# Altium project MAIN_BOARD.PrjPcb (part 3 of 3)

## Sheet NVME.SchDoc
size B; SheetNumber: 7; SheetTotal: 8
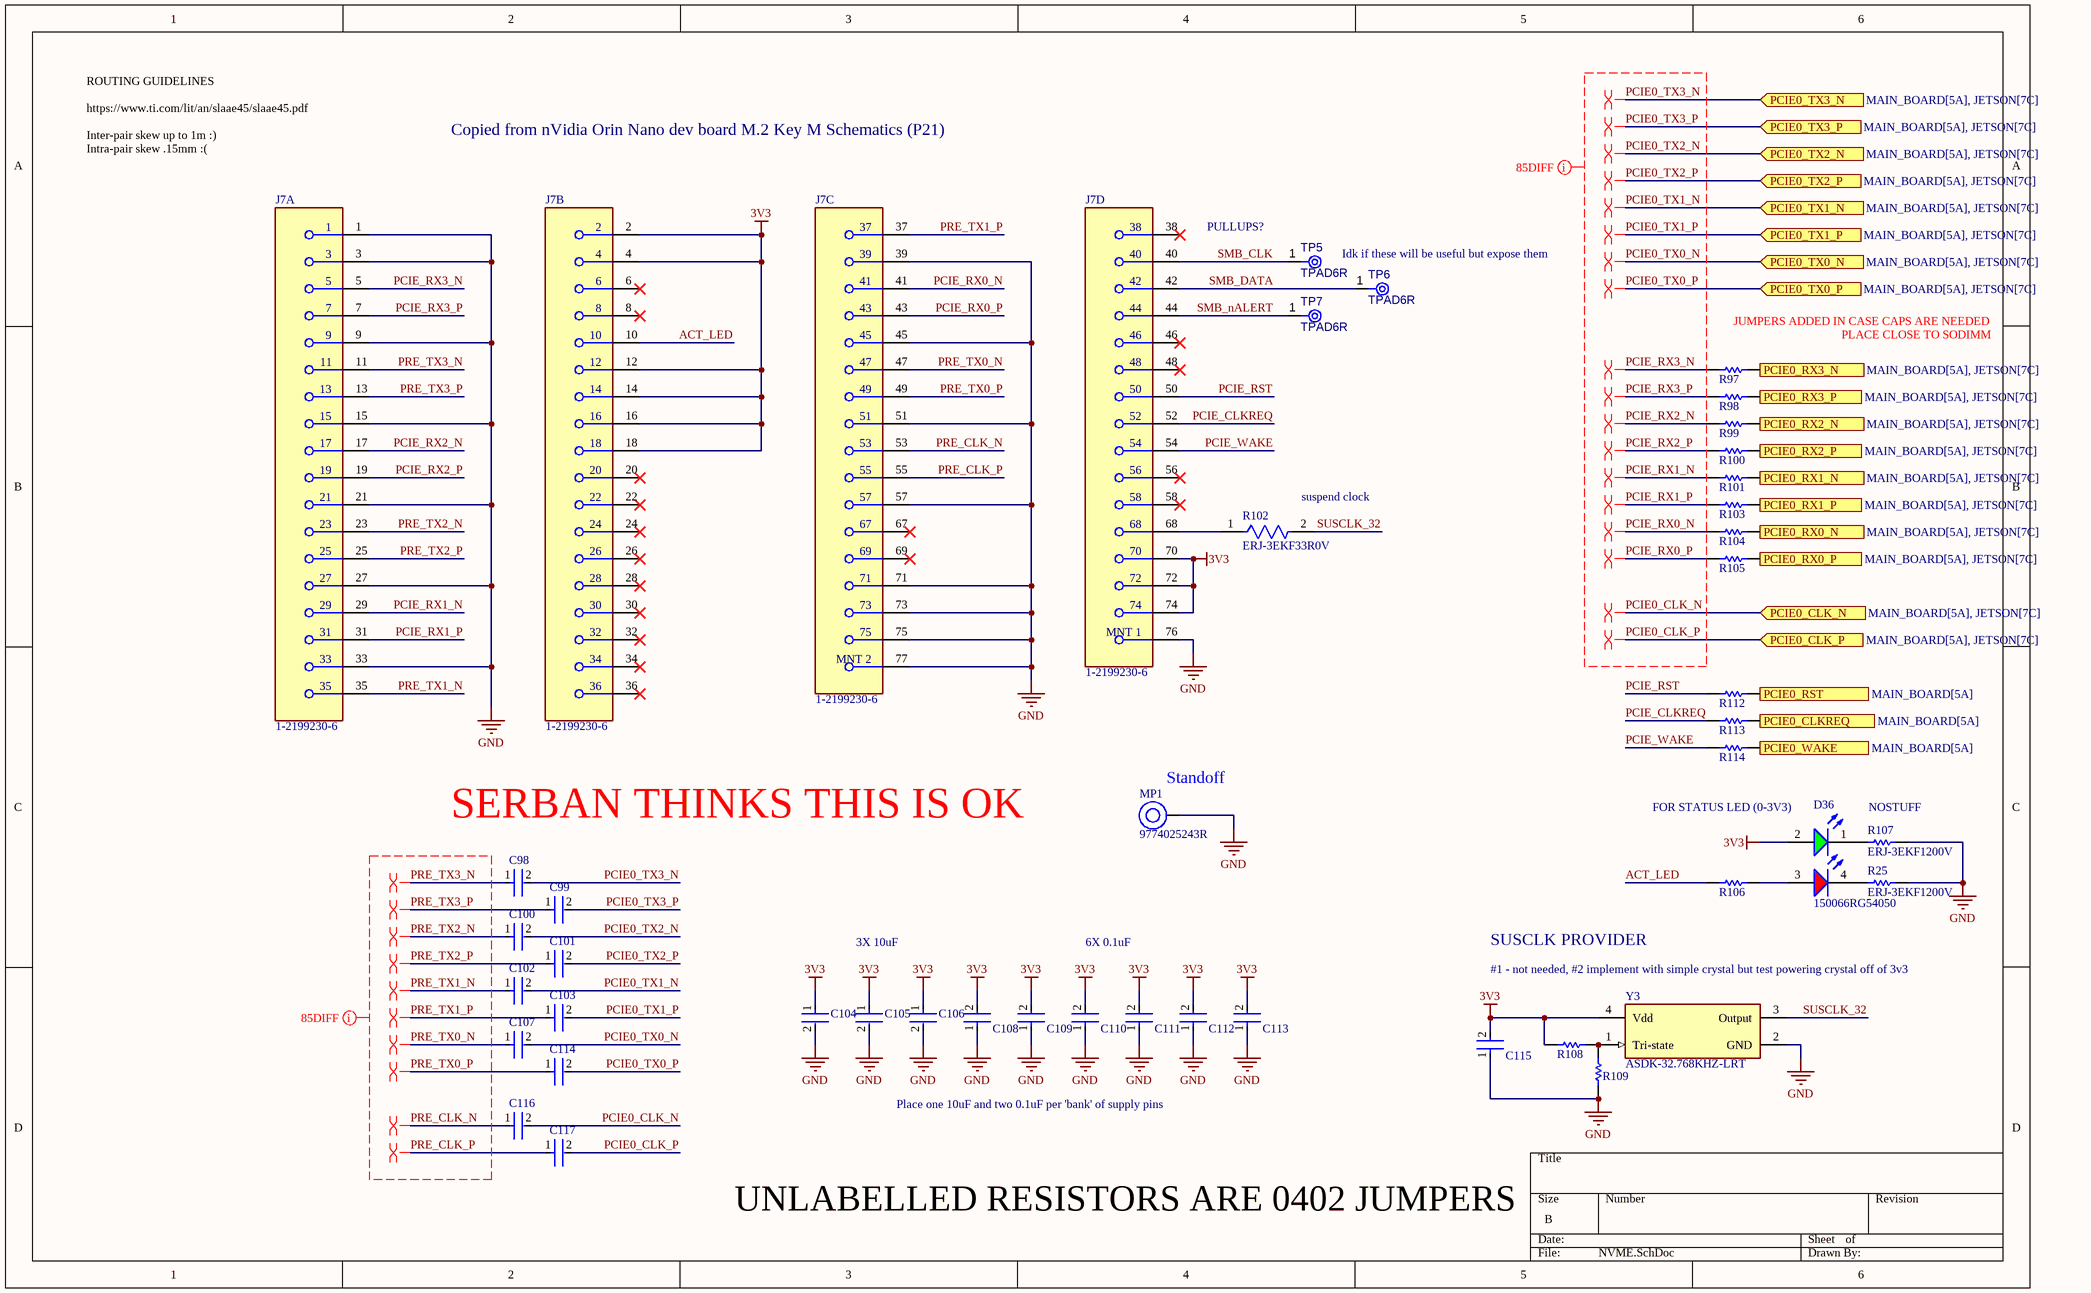
[diagram p17: NVME.SchDoc]

### Parts
C98  C1005X7R1A224K050BB  [FP-C1005-050-0_05-IPC_C]  (value not drawn)
C99  C1005X7R1A224K050BB  [FP-C1005-050-0_05-IPC_C]  (value not drawn)
C100  C1005X7R1A224K050BB  [FP-C1005-050-0_05-IPC_C]  (value not drawn)
C101  C1005X7R1A224K050BB  [FP-C1005-050-0_05-IPC_C]  (value not drawn)
C102  C1005X7R1A224K050BB  [FP-C1005-050-0_05-IPC_C]  (value not drawn)
C103  C1005X7R1A224K050BB  [FP-C1005-050-0_05-IPC_C]  (value not drawn)
C104  GRM188R60J106ME47D  [FP-GRM188-0_1-e0_2_0_55-IPC_A]  (value not drawn)
C105  GRM188R60J106ME47D  [FP-GRM188-0_1-e0_2_0_55-IPC_A]  (value not drawn)
C106  GRM188R60J106ME47D  [FP-GRM188-0_1-e0_2_0_55-IPC_A]  (value not drawn)
C107  C1005X7R1A224K050BB  [FP-C1005-050-0_05-IPC_C]  (value not drawn)
C108  C1005X7R1H104K050BB  [FP-C1005-050-0_05-IPC_C]  (value not drawn)
C109  C1005X7R1H104K050BB  [FP-C1005-050-0_05-IPC_C]  (value not drawn)
C110  C1005X7R1H104K050BB  [FP-C1005-050-0_05-IPC_C]  (value not drawn)
C111  C1005X7R1H104K050BB  [FP-C1005-050-0_05-IPC_C]  (value not drawn)
C112  C1005X7R1H104K050BB  [FP-C1005-050-0_05-IPC_C]  (value not drawn)
C113  C1005X7R1H104K050BB  [FP-C1005-050-0_05-IPC_C]  (value not drawn)
C114  C1005X7R1A224K050BB  [FP-C1005-050-0_05-IPC_C]  (value not drawn)
C115  C1005X7R1H104K050BB  [FP-C1005-050-0_05-IPC_C]  (value not drawn)
C116  C1005X7R1A224K050BB  [FP-C1005-050-0_05-IPC_C]  (value not drawn)
C117  C1005X7R1A224K050BB  [FP-C1005-050-0_05-IPC_C]  (value not drawn)
D36  150066RG54050  [WL-SBCD_0606]
J7  1-2199230-6  [FP-1-2199230-6-MFG]  (parts A,B,C,D of 4)
MP1  9774025243R  [9774025243]
R25  ERJ-3EKF1200V  [RESC1609X55X30ML15T15]
R97  0402 JUMPER 0 OHM  [RESC1005X40X25NL05T05]  (value not drawn)
R98  0402 JUMPER 0 OHM  [RESC1005X40X25NL05T05]  (value not drawn)
R99  0402 JUMPER 0 OHM  [RESC1005X40X25NL05T05]  (value not drawn)
R100  0402 JUMPER 0 OHM  [RESC1005X40X25NL05T05]  (value not drawn)
R101  0402 JUMPER 0 OHM  [RESC1005X40X25NL05T05]  (value not drawn)
R102  ERJ-3EKF33R0V  [FP-ERJ3EK-MFG]
R103  0402 JUMPER 0 OHM  [RESC1005X40X25NL05T05]  (value not drawn)
R104  0402 JUMPER 0 OHM  [RESC1005X40X25NL05T05]  (value not drawn)
R105  0402 JUMPER 0 OHM  [RESC1005X40X25NL05T05]  (value not drawn)
R106  0402 JUMPER 0 OHM  [RESC1005X40X25NL05T05]  (value not drawn)
R107  ERJ-3EKF1200V  [RESC1609X55X30ML15T15]
R108  0402 JUMPER 0 OHM  [RESC1005X40X25NL05T05]  (value not drawn)
R109  0402 JUMPER 0 OHM  [RESC1005X40X25NL05T05]  (value not drawn)
R112  0402 JUMPER 0 OHM  [RESC1005X40X25NL05T05]  (value not drawn)
R113  0402 JUMPER 0 OHM  [RESC1005X40X25NL05T05]  (value not drawn)
R114  0402 JUMPER 0 OHM  [RESC1005X40X25NL05T05]  (value not drawn)
TP5  TPAD6R  [TP06R]  (no BOM)
TP6  TPAD6R  [TP06R]  (no BOM)
TP7  TPAD6R  [TP06R]  (no BOM)
Y3  ASDK-32.768KHZ-LRT  [FP-ASDK-MFG]

### Ports
PCIE0_CLK_N (in, see MAIN_BOARD[5A], JETSON[7C]), PCIE0_CLK_P (in, see MAIN_BOARD[5A], JETSON[7C]), PCIE0_CLKREQ (out, see MAIN_BOARD[5A]), PCIE0_RST (in, see MAIN_BOARD[5A]), PCIE0_RX0_N (out, see MAIN_BOARD[5A], JETSON[7C]), PCIE0_RX0_P (out, see MAIN_BOARD[5A], JETSON[7C]), PCIE0_RX1_N (out, see MAIN_BOARD[5A], JETSON[7C]), PCIE0_RX1_P (out, see MAIN_BOARD[5A], JETSON[7C]), PCIE0_RX2_N (out, see MAIN_BOARD[5A], JETSON[7C]), PCIE0_RX2_P (out, see MAIN_BOARD[5A], JETSON[7C]), PCIE0_RX3_N (out, see MAIN_BOARD[5A], JETSON[7C]), PCIE0_RX3_P (out, see MAIN_BOARD[5A], JETSON[7C]), PCIE0_TX0_N (in, see MAIN_BOARD[5A], JETSON[7C]), PCIE0_TX0_P (in, see MAIN_BOARD[5A], JETSON[7C]), PCIE0_TX1_N (in, see MAIN_BOARD[5A], JETSON[7C]), PCIE0_TX1_P (in, see MAIN_BOARD[5A], JETSON[7C]), PCIE0_TX2_N (in, see MAIN_BOARD[5A], JETSON[7C]), PCIE0_TX2_P (in, see MAIN_BOARD[5A], JETSON[7C]), PCIE0_TX3_N (in, see MAIN_BOARD[5A], JETSON[7C]), PCIE0_TX3_P (in, see MAIN_BOARD[5A], JETSON[7C]), PCIE0_WAKE (out, see MAIN_BOARD[5A])

### Nets
3V3: C104.1 C105.1 C106.1 C108.2 C109.2 C110.2 C111.2 C112.2 C113.2 C115.2 D36.2(A) J7.2 J7.4 J7.12 J7.14 J7.16 J7.18 J7.70 J7.72 J7.74 R108.1 Y3.4(Vdd)
GND: C104.2 C105.2 C106.2 C108.1 C109.1 C110.1 C111.1 C112.1 C113.1 C115.1 J7.1 J7.3 J7.9 J7.15 J7.21 J7.27 J7.33 J7.39 J7.45 J7.51 J7.57 J7.71 J7.73 J7.75 J7.76(MNT_1) J7.77(MNT_2) MP1.1 R25.1 R107.1 R109.1 Y3.2(GND)
ACT_LED: J7.10 R106.1
PCIE0_CLK_N: C116.2 ; port PCIE0_CLK_N
PCIE0_CLK_P: C117.2 ; port PCIE0_CLK_P
PCIE0_nRST: R112.2 ; port PCIE0_RST
PCIE0_RX0_N: R104.2 ; port PCIE0_RX0_N
PCIE0_RX0_P: R105.2 ; port PCIE0_RX0_P
PCIE0_RX1_N: R101.2 ; port PCIE0_RX1_N
PCIE0_RX1_P: R103.2 ; port PCIE0_RX1_P
PCIE0_RX2_N: R99.2 ; port PCIE0_RX2_N
PCIE0_RX2_P: R100.2 ; port PCIE0_RX2_P
PCIE0_RX3_N: R97.2 ; port PCIE0_RX3_N
PCIE0_RX3_P: R98.2 ; port PCIE0_RX3_P
PCIE0_TX0_N: C107.2 ; port PCIE0_TX0_N
PCIE0_TX0_P: C114.2 ; port PCIE0_TX0_P
PCIE0_TX1_N: C102.2 ; port PCIE0_TX1_N
PCIE0_TX1_P: C103.2 ; port PCIE0_TX1_P
PCIE0_TX2_N: C100.2 ; port PCIE0_TX2_N
PCIE0_TX2_P: C101.2 ; port PCIE0_TX2_P
PCIE0_TX3_N: C98.2 ; port PCIE0_TX3_N
PCIE0_TX3_P: C99.2 ; port PCIE0_TX3_P
PCIE_CLKREQ: J7.52 R113.1
PCIE_RST: J7.50 R112.1
PCIE_RX0_N: J7.41 R104.1
PCIE_RX0_P: J7.43 R105.1
PCIE_RX1_N: J7.29 R101.1
PCIE_RX1_P: J7.31 R103.1
PCIE_RX2_N: J7.17 R99.1
PCIE_RX2_P: J7.19 R100.1
PCIE_RX3_N: J7.5 R97.1
PCIE_RX3_P: J7.7 R98.1
PCIE_WAKE: J7.54 R114.1
PRE_CLK_N: C116.1 J7.53
PRE_CLK_P: C117.1 J7.55
PRE_TX0_N: C107.1 J7.47
PRE_TX0_P: C114.1 J7.49
PRE_TX1_N: C102.1 J7.35
PRE_TX1_P: C103.1 J7.37
PRE_TX2_N: C100.1 J7.23
PRE_TX2_P: C101.1 J7.25
PRE_TX3_N: C98.1 J7.11
PRE_TX3_P: C99.1 J7.13
SMB_CLK: J7.40 TP5.1(TP)
SMB_DATA: J7.42 TP6.1(TP)
SMB_nALERT: J7.44 TP7.1(TP)
SUSCLK_32: R102.2 Y3.3(Output)
NetD36_1: D36.1(K) R107.2
NetD36_3: D36.3(A) R106.2
NetD36_4: D36.4(K) R25.2
NetJ7_68: J7.68 R102.1
NetR108_2: R108.2 R109.2 Y3.1(Tri-state)
NetR113_2: R113.2 ; port PCIE0_CLKREQ
NetR114_2: R114.2 ; port PCIE0_WAKE

Not connected (* = marked no-connect by the designer): J7 6* 8* 20* 22* 24* 26* 28* 30* 32* 34* 36* 38* 46* 48* 56* 58* 67* 69*

### Layout directives
differential pair: PCIE0_CLK_N, PCIE0_CLK_P, PCIE0_TX0_N, PCIE0_TX0_P, PCIE0_TX1_N, PCIE0_TX1_P, PCIE0_TX2_N, PCIE0_TX2_P, PCIE0_TX3_N, PCIE0_TX3_P, PCIE_RX0_N, PCIE_RX0_P, PCIE_RX1_N, PCIE_RX1_P, PCIE_RX2_N, PCIE_RX2_P, PCIE_RX3_N, PCIE_RX3_P, PRE_CLK_N, PRE_CLK_P, PRE_TX0_N, PRE_TX0_P, PRE_TX1_N, PRE_TX1_P, PRE_TX2_N, PRE_TX2_P, PRE_TX3_N, PRE_TX3_P
net class 85DIFF: PCIE0_CLK_N, PCIE0_CLK_P, PCIE0_TX0_N, PCIE0_TX0_P, PCIE0_TX1_N, PCIE0_TX1_P, PCIE0_TX2_N, PCIE0_TX2_P, PCIE0_TX3_N, PCIE0_TX3_P, PCIE_RX0_N, PCIE_RX0_P, PCIE_RX1_N, PCIE_RX1_P, PCIE_RX2_N, PCIE_RX2_P, PCIE_RX3_N, PCIE_RX3_P, PRE_CLK_N, PRE_CLK_P, PRE_TX0_N, PRE_TX0_P, PRE_TX1_N, PRE_TX1_P, PRE_TX2_N, PRE_TX2_P, PRE_TX3_N, PRE_TX3_P

### Notes on the sheet
- ROUTING GUIDELINES
  https://www.ti.com/lit/an/slaae45/slaae45.pdf
  Inter-pair skew up to 1m :)
  Intra-pair skew .15mm :(
- Copied from nVidia Orin Nano dev board M.2 Key M Schematics (P21)
- PULLUPS?
- Idk if these will be useful but expose them
- (near R97) JUMPERS ADDED IN CASE CAPS ARE NEEDED
- PLACE CLOSE TO SODIMM
- (near R102) suspend clock
- SERBAN THINKS THIS IS OK
- (near MP1) Standoff
- FOR STATUS LED (0-3V3)
- (near R107) NOSTUFF
- 3X 10uF
- 6X 0.1uF
- SUSCLK PROVIDER
- #1 - not needed, #2 implement with simple crystal but test powering crystal off of 3v3
- Place one 10uF and two 0.1uF per 'bank' of supply pins
- UNLABELLED RESISTORS ARE 0402 JUMPERS

### Library data of the parts
C98-C103 C107 C114 C116 C117 = CMP-08246-006072-1: Multilayer Ceramic Capacitors 220nF ±10% 10V X7R SMD 0402; Resistor Type: Ceramic; Dielectric: X7R; Voltage Rating (DC): 10V; Width: 0.02inch; Case Code (Metric): 1005; Mount: Surface Mount; Termination: SMD/SMT; Series: C; Tolerance: 10%; Depth: 0.5mm; Length: 1mm; Packaging: Tape and Reel; Radiation Hardening: No; Weight: 2.3E-05oz; Voltage Rating: 10V; Thickness: 0.022inch; Capacitance: 220nF; Case Code (Imperial): 0402; Lead Free: Lead Free; Case/Package: 0402; Package Quantity: 10000; Dielectric Material: Ceramic; RoHS Compliant: Yes; REACH SVHC: No SVHC; Min Operating Temperature: -55°C; Max Operating Temperature: 125°C; Height: 0.5mm; Construction: Flat
C104-C106 = CMP-2006-02792-2: Chip Multilayer Ceramic Capacitors for General Purpose, 0603, 10uF, X5R, 15%, 20%, 6.3V; Packaging: Tape and Reel; Voltage Rating (DC): 6.3V; Width: 0.031inch; Termination: SMD/SMT; Dielectric: X5R; Package Quantity: 4000; Voltage Rating: 6.3V; Capacitance: 10uF; Case/Package: 0603; Min Operating Temperature: -55°C; Voltage: 6.3V; Length: 1.6mm; Thickness: 0.035inch; Lead Free: Lead Free; Depth: 0.8mm; Case Code (Imperial): 0603; Max Operating Temperature: 85°C; Material: Ceramic; Height: 0.8mm; Tolerance: 20%; Mount: Surface Mount; REACH SVHC: No SVHC; Radiation Hardening: No; Case Code (Metric): 1608
C108-C113 C115 = CMP-2000-05393-2: Multilayer Ceramic Capacitors 100nF ±10% 50V X7R SMD 0402; Voltage: 50V; Dielectric Material: Ceramic; Min Operating Temperature: -55°C; Depth: 0.5mm; Radiation Hardening: No; RoHS Compliant: Yes; Voltage Rating (DC): 50V; Lead Free: Lead Free; Resistor Type: Ceramic; Height: 0.5mm; Dielectric: X7R; Thickness: 0.022inch; Case/Package: 0402; Case Code (Metric): 1005; Termination: SMD/SMT; Capacitance: 100nF; Packaging: Tape and Reel; Max Operating Temperature: 125°C; Mount: Surface Mount; Package Quantity: 1; Width: 0.02inch; Weight: 2.3E-05oz; Voltage Rating: 50V; Tolerance: 10%; Construction: Flat; Case Code (Imperial): 0402; Length: 1mm; REACH SVHC: No SVHC; Series: C
D36 = CMP-004-00034-2: Led, Red/Grn, 180Mcd/230Mcd, 624Nm/525Nm Rohs Compliant: Yes
J7 = CMP-03365-000001-1: CONN EDGE DUAL FMALE 67POS 0.020; Manufacturer: TE; Number Of Contacts: 67; Current Rating: 0.5A; Pitch: 0.5mm; Conn Gender: Female; Is Female: yes; Voltage Rating: 50V; Conn Orientation: Right Angle; Automotive: No; Temperature Range High: +80°C; Package: 1-2199230-6; Category: Conn; Temperature: -40°C to +80°C; Number Of Rows: 2; ComponentLink2URL: http://www.te.com/commerce/DocumentDelivery/DDEController?Action=showdoc&DocId=Specification+Or+Standard%7F114-115006%7FB%7Fpdf%7FEnglish%7FENG_SS_114-115006_B_114-115006_REV_B.pdf%7F1-2199230-6; Manufacturer Part Number: 1-2199230-6; Height: 4.2mm; RoHS: TRUE; Footprint Url: http://www.te.com/commerce/DocumentDelivery/DDEController?Action=showdoc&DocId=Customer+Drawing%7F2199230%7FB2%7Fpdf%7FEnglish%7FENG_CD_2199230_B2.pdf%7F1-2199230-6; Digikey Description: CONN EDGE DUAL FMALE 67POS 0.020; Device Class L2: Card Edge Connectors; Contact Material: Gold,Tin; Device Class L1: Connectors; Device Class L3: unset; ComponentLink2Description: Datasheet; Temperature Range Low: -40°C; Octopart: https://octopart.com/1-2199230-6-te+connectivity-34969376; Lead Free: Yes
MP1 = CMP-03913-59774857-1: 9774025243R Spacer Material: Steel, Tin-Plated Mounting: SMT Series: WA-SMST Thread D: M2; Outside Diameter: 4.3434mm; Threaded/Unthreaded: Threaded; Plating: Tin; REACH SVHC: Unknown; NexarPartId: 59774857; RoHS: Compliant; Material: Steel; Packaging: Tape and Reel; Max Operating Temperature: 150°C; Min Operating Temperature: -55°C; Length: 2.5mm; Height: 2.5mm
R25 R107 = CMP-2000-00213-2: Chip Resistor, 120 Ohm, +/- 1%, 0.1 W, -55 to 155 degC, 0603 (1608 Metric), RoHS, Tape and Reel; Manufacturer: Panasonic; Power Rating: 100mW; Voltage Rating (DC): 75V; Resistance: 120Ohm; Temperature Coefficient: 100ppm/degreesC; Number of Terminations: 2; Military Standard: Not; Tolerance: 1%; Min Operating Temperature: -55degC; Packaging: TapeandReel; Lead Free: LeadFree; Max Operating Temperature: 155degC; Manufacturer URL: http://www.panasonic.com/; Case Code (Imperial): 0603; REACH SVHC: NoSVHC; Width: 0.031inch; Datasheet URL: https://industrial.panasonic.com/cdbs/www-data/pdf/RDA0000/AOA0000C283.pdf; RoHSCompliant: true; Max Power Dissipation: 100mW; Termination: SMD/SMT; Package Reference: 0603; Height: 0.022inch; Depth: 0.8mm; Package Description: 2-Pin Surface Mount Device, Body 1.6 x 0.85 mm; Contact Plating: Tin; Length: 1.6mm; Package URL: http://www.st.com/st-web-ui/static/active/en/resource/technical/document/datasheet/CD00001320.pdf; Radiation Hardening: No; Package Quantity: 1; Number of Pins: 2; Datasheet Version: 42095.0; Voltage Rating: 75V; Composition: ThickFilm; Case/Package: 0603; Mount: SurfaceMount; Case Code (Metric): 1608
R97-R101 R103-R106 R108 R109 R112-R114 = CMP-009-00206-2: READ THE NAME
R102 = CMP-2000-00443-2: RES SMD 33 OHM 1% 1/10W 0603; Voltage Rating (DC): 75V; Power Rating: 100mW; Resistance: 33R; Temperature Coefficient: 100ppm/°C; Min Operating Temperature: -55°C; Packaging: Tape and Reel; Mount: Surface Mount; Lead Free: Lead Free; Voltage Rating: 75V; Features: Automotive AEC-Q200; Height: 0.022inch; Width: 0.031inch; Number of Pins: 2; Package Quantity: 1; Case Code (Metric): 1608; Max Power Dissipation: 100mW; Case Code (Imperial): 0603; Termination: SMD/SMT; Resistance Tolerance: 1%; Max Operating Temperature: 155°C; Tolerance: 1%; Length: 1.6mm; Case/Package: 0603; Military Standard: Not; RoHS Compliant: Yes; Series: ERJ; Size Code: 0603; Construction: Rectangular; Number of Terminations: 2; Radiation Hardening: No; Resistor Type: Thick Film; Contact Plating: Tin; Depth: 0.8mm; REACH SVHC: No SVHC
TP5-TP7 = CMP-00028-00002-2: 0.6mm round; Pins: 1
Y3 = CMP-27762-001115-1: XTAL OSC XO 32.7680KHZ CMOS SMD; Load Capacitance: 15pF; Max Supply Current: 3.5mA; Min Supply Voltage: 2.97V; Operating Supply Voltage: 3.3V; Frequency Stability: 25ppm; Lead Free: Lead Free; Case/Package: CSMD; Number of Pins: 4; Max Operating Temperature: 85°C; Packaging: Tape and Reel; Width: 0.079inch; Min Operating Temperature: -40°C; Radiation Hardening: No; Length: 2.5mm; Depth: 2mm; Termination: SMD/SMT; Height: 0.037inch; Series: ASDK; Frequency: 32.768kHz; Mount: Surface Mount

## Sheet CAMERA_INTERFACE.SchDoc
size C; SheetNumber: 3; SheetTotal: 8
Used 2 times, as channels CAMIF_1, CAMIF_2. Parts and nets are listed once, with the designators drawn on the sheet.
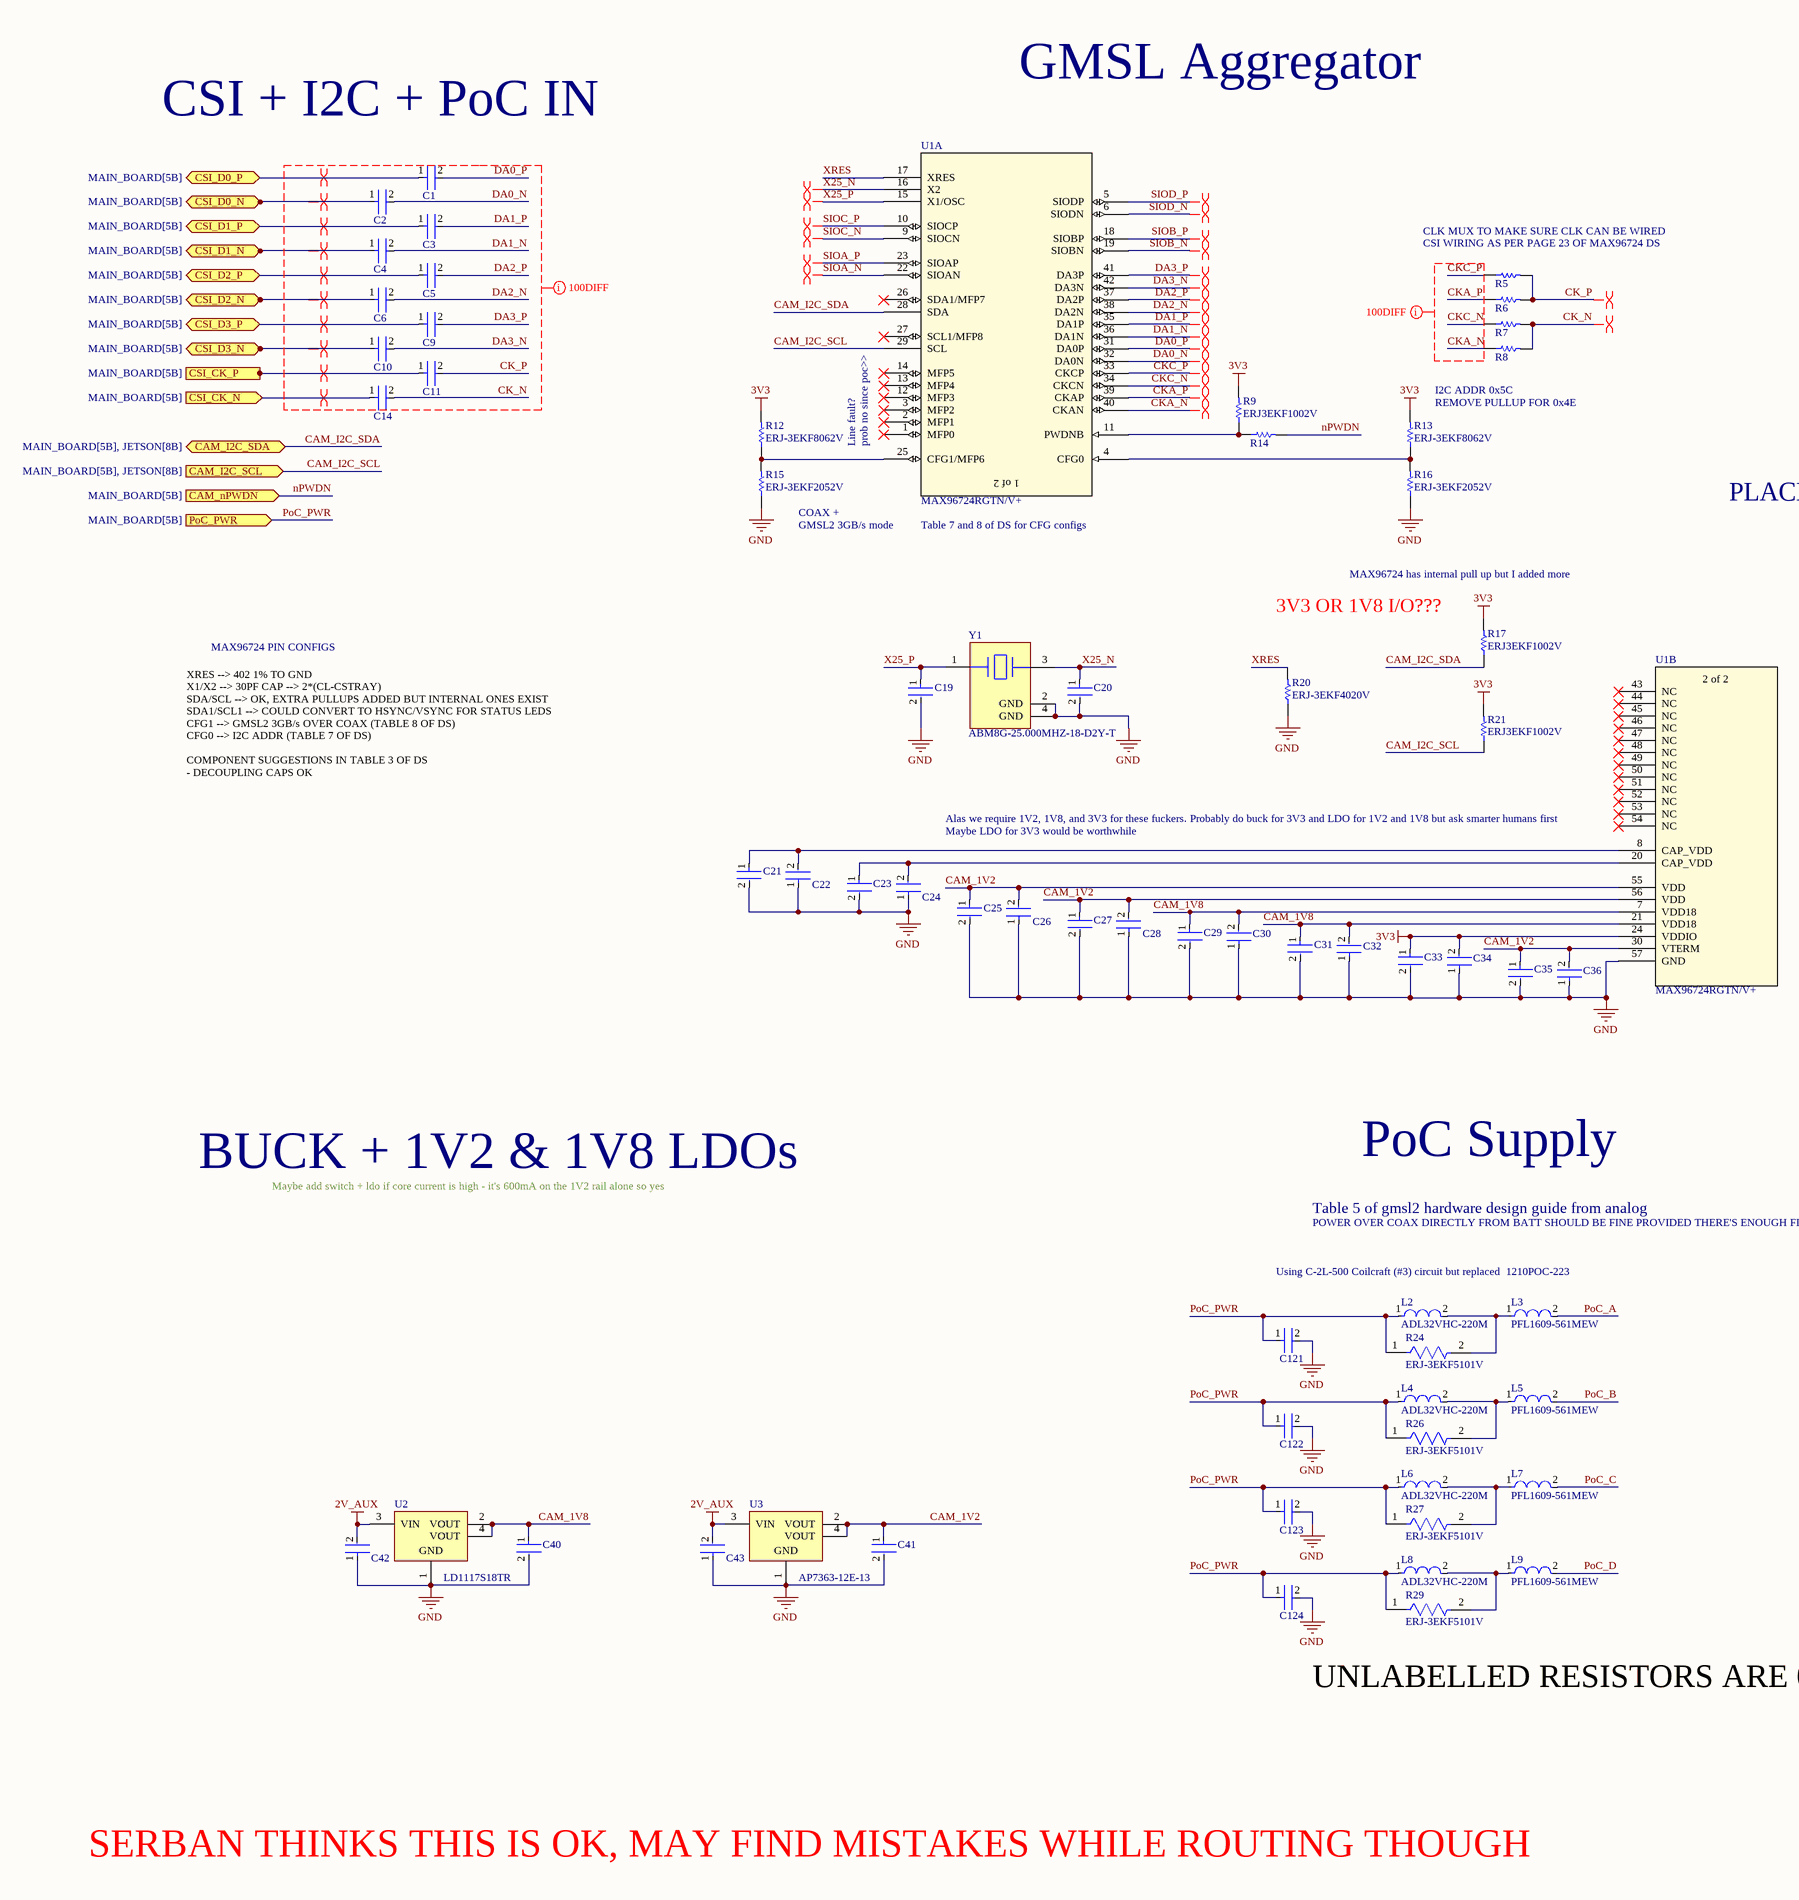
[diagram p18: CAMERA_INTERFACE.SchDoc, left]
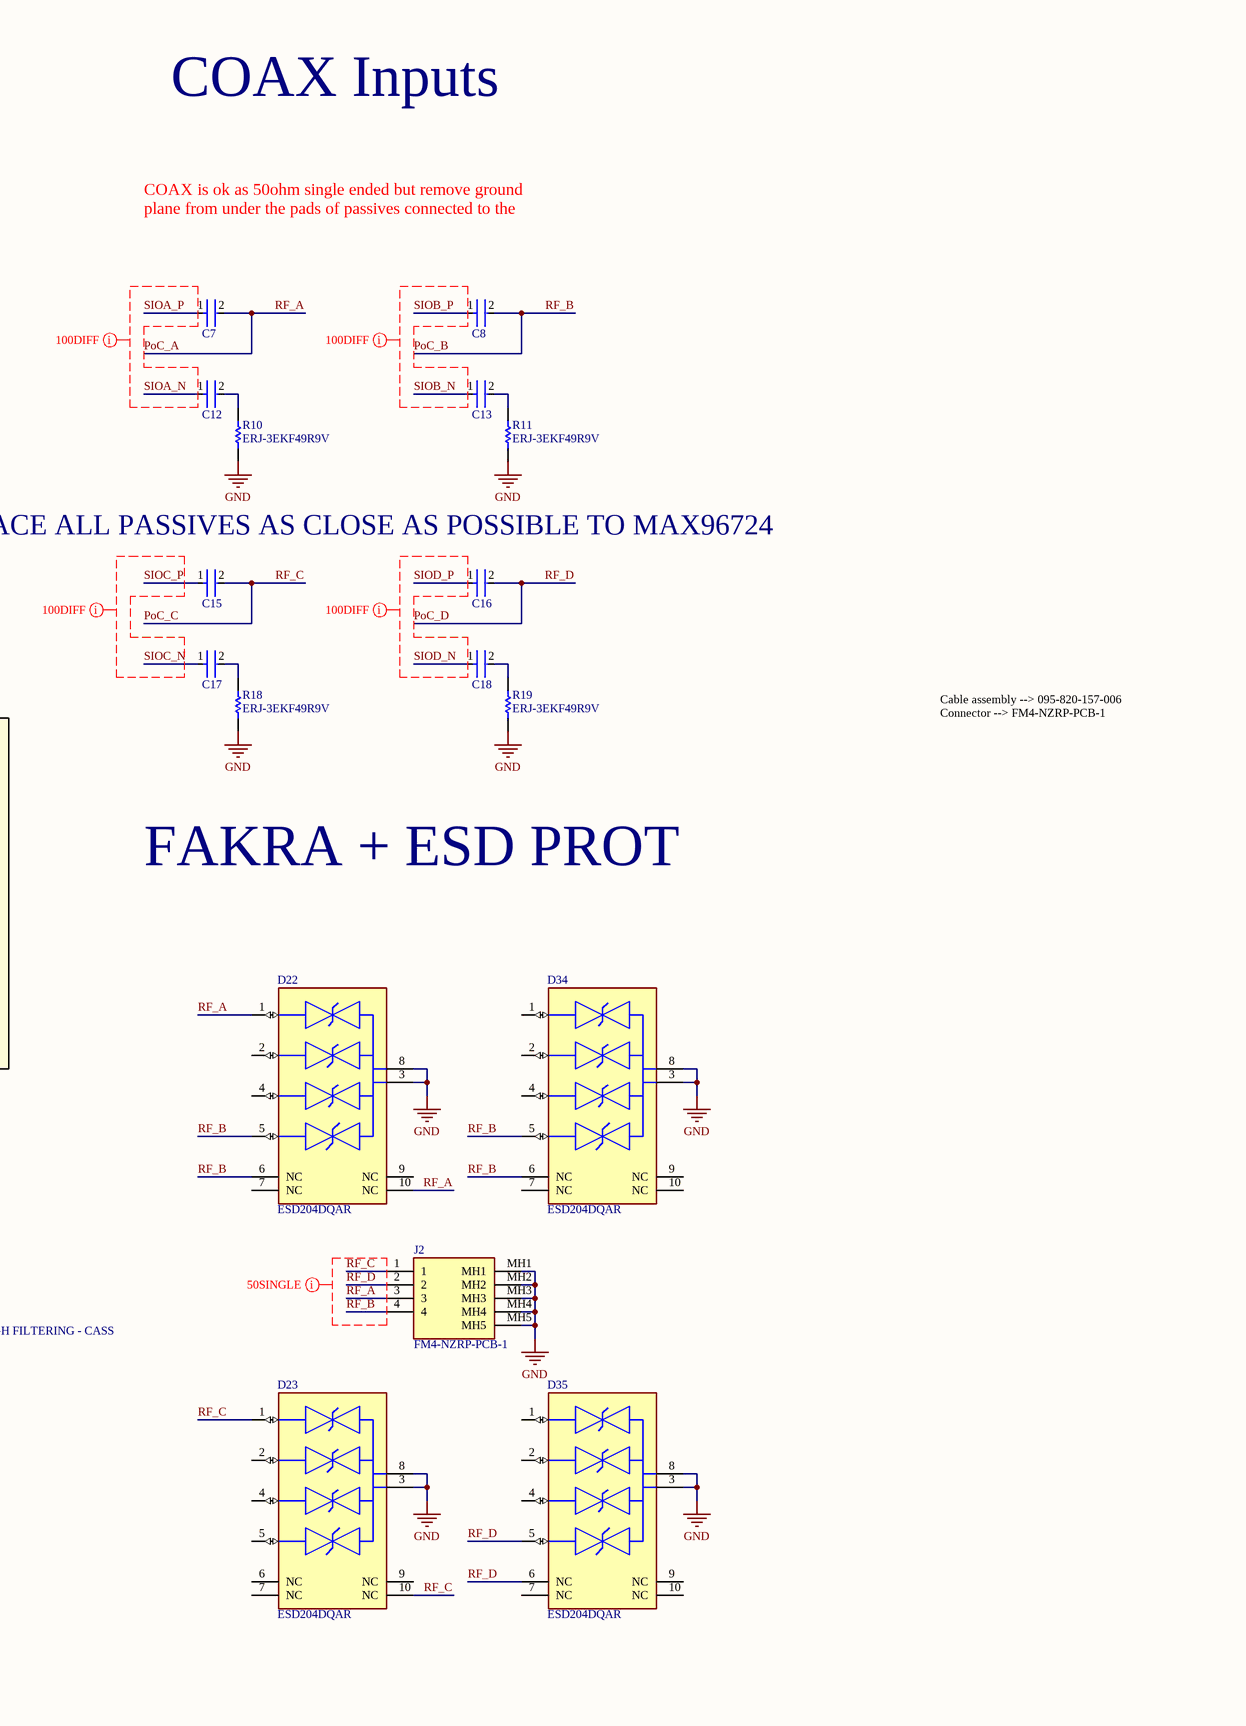
[diagram p19: CAMERA_INTERFACE.SchDoc, right]

### Parts
C1  C1005X7R1H104K050BB  [FP-C1005-050-0_05-IPC_C]  (value not drawn)
C2  C1005X7R1H104K050BB  [FP-C1005-050-0_05-IPC_C]  (value not drawn)
C3  C1005X7R1H104K050BB  [FP-C1005-050-0_05-IPC_C]  (value not drawn)
C4  C1005X7R1H104K050BB  [FP-C1005-050-0_05-IPC_C]  (value not drawn)
C5  C1005X7R1H104K050BB  [FP-C1005-050-0_05-IPC_C]  (value not drawn)
C6  C1005X7R1H104K050BB  [FP-C1005-050-0_05-IPC_C]  (value not drawn)
C7  C1005X7R1H104K050BB  [FP-C1005-050-0_05-IPC_C]  (value not drawn)
C8  C1005X7R1H104K050BB  [FP-C1005-050-0_05-IPC_C]  (value not drawn)
C9  C1005X7R1H104K050BB  [FP-C1005-050-0_05-IPC_C]  (value not drawn)
C10  C1005X7R1H104K050BB  [FP-C1005-050-0_05-IPC_C]  (value not drawn)
C11  C1005X7R1H104K050BB  [FP-C1005-050-0_05-IPC_C]  (value not drawn)
C12  C1005X7R1H104K050BB  [FP-C1005-050-0_05-IPC_C]  (value not drawn)
C13  C1005X7R1H104K050BB  [FP-C1005-050-0_05-IPC_C]  (value not drawn)
C14  C1005X7R1H104K050BB  [FP-C1005-050-0_05-IPC_C]  (value not drawn)
C15  C1005X7R1H104K050BB  [FP-C1005-050-0_05-IPC_C]  (value not drawn)
C16  C1005X7R1H104K050BB  [FP-C1005-050-0_05-IPC_C]  (value not drawn)
C17  C1005X7R1H104K050BB  [FP-C1005-050-0_05-IPC_C]  (value not drawn)
C18  C1005X7R1H104K050BB  [FP-C1005-050-0_05-IPC_C]  (value not drawn)
C19  C0603C300J5GACTU  [FP-C0603C-CF-MFG]  (value not drawn)
C20  C0603C300J5GACTU  [FP-C0603C-CF-MFG]  (value not drawn)
C21  CL05A106MP5NUNC  [FP-CL05A106MP5NUNC-MFG]  (value not drawn)
C22  C1005X7R1H104K050BB  [FP-C1005-050-0_05-IPC_C]  (value not drawn)
C23  CL05A106MP5NUNC  [FP-CL05A106MP5NUNC-MFG]  (value not drawn)
C24  C1005X7R1H104K050BB  [FP-C1005-050-0_05-IPC_C]  (value not drawn)
C25  CL05A106MP5NUNC  [FP-CL05A106MP5NUNC-MFG]  (value not drawn)
C26  C1005X7R1H104K050BB  [FP-C1005-050-0_05-IPC_C]  (value not drawn)
C27  CL05A106MP5NUNC  [FP-CL05A106MP5NUNC-MFG]  (value not drawn)
C28  C1005X7R1H104K050BB  [FP-C1005-050-0_05-IPC_C]  (value not drawn)
C29  CL05A106MP5NUNC  [FP-CL05A106MP5NUNC-MFG]  (value not drawn)
C30  C0402C103M5RACTU  [FP-C0402-BB-MFG]  (value not drawn)
C31  CL05A106MP5NUNC  [FP-CL05A106MP5NUNC-MFG]  (value not drawn)
C32  C0402C103M5RACTU  [FP-C0402-BB-MFG]  (value not drawn)
C33  CL05A106MP5NUNC  [FP-CL05A106MP5NUNC-MFG]  (value not drawn)
C34  C0402C103M5RACTU  [FP-C0402-BB-MFG]  (value not drawn)
C35  CL05A106MP5NUNC  [FP-CL05A106MP5NUNC-MFG]  (value not drawn)
C36  C0402C103M5RACTU  [FP-C0402-BB-MFG]  (value not drawn)
C40  GRM188R60J106ME47D  [FP-GRM188-0_1-e0_2_0_55-IPC_A]  (value not drawn)
C41  GRM188R60J106ME47D  [FP-GRM188-0_1-e0_2_0_55-IPC_A]  (value not drawn)
C42  C1005X7R1H104K050BB  [FP-C1005-050-0_05-IPC_C]  (value not drawn)
C43  C1005X7R1H104K050BB  [FP-C1005-050-0_05-IPC_C]  (value not drawn)
C121  GRM21BR61E226ME44L  [FP-GRM21B-0_2-e0_2_0_7-IPC_B]  (value not drawn)
C122  GRM21BR61E226ME44L  [FP-GRM21B-0_2-e0_2_0_7-IPC_B]  (value not drawn)
C123  GRM21BR61E226ME44L  [FP-GRM21B-0_2-e0_2_0_7-IPC_B]  (value not drawn)
C124  GRM21BR61E226ME44L  [FP-GRM21B-0_2-e0_2_0_7-IPC_B]  (value not drawn)
D22  ESD204DQAR  [FP-DQA0010A-MFG]
D23  ESD204DQAR  [FP-DQA0010A-MFG]
D34  ESD204DQAR  [FP-DQA0010A-MFG]
D35  ESD204DQAR  [FP-DQA0010A-MFG]
J2  FM4-NZRP-PCB-1  [FM4-NZRP-PCB-1-Footprint-1]
L2  ADL32VHC-220M  [FP-1210POC-MFG]
L3  PFL1609-561MEW  [FP-PFL1609-MFG]
L4  ADL32VHC-220M  [FP-1210POC-MFG]
L5  PFL1609-561MEW  [FP-PFL1609-MFG]
L6  ADL32VHC-220M  [FP-1210POC-MFG]
L7  PFL1609-561MEW  [FP-PFL1609-MFG]
L8  ADL32VHC-220M  [FP-1210POC-MFG]
L9  PFL1609-561MEW  [FP-PFL1609-MFG]
R5  0402 JUMPER 0 OHM  [RESC1005X40X25NL05T05]  (value not drawn)
R6  0402 JUMPER 0 OHM  [RESC1005X40X25NL05T05]  (value not drawn)
R7  0402 JUMPER 0 OHM  [RESC1005X40X25NL05T05]  (value not drawn)
R8  0402 JUMPER 0 OHM  [RESC1005X40X25NL05T05]  (value not drawn)
R9  ERJ3EKF1002V  [RESC1609X55X30LL15T15]
R10  ERJ-3EKF49R9V  [RESC1608X55X30ML15T15]
R11  ERJ-3EKF49R9V  [RESC1608X55X30ML15T15]
R12  ERJ-3EKF8062V  [RESC1608X55X30LL15T15]
R13  ERJ-3EKF8062V  [RESC1608X55X30LL15T15]
R14  0402 JUMPER 0 OHM  [RESC1005X40X25NL05T05]  (value not drawn)
R15  ERJ-3EKF2052V  [RESC1608X55X30NL15T15]
R16  ERJ-3EKF2052V  [RESC1608X55X30NL15T15]
R17  ERJ3EKF1002V  [RESC1609X55X30LL15T15]
R18  ERJ-3EKF49R9V  [RESC1608X55X30ML15T15]
R19  ERJ-3EKF49R9V  [RESC1608X55X30ML15T15]
R20  ERJ-3EKF4020V  [RESC1608X55X30LL15T15]
R21  ERJ3EKF1002V  [RESC1609X55X30LL15T15]
R24  ERJ-3EKF5101V  [FP-ERJ3EK-MFG]
R26  ERJ-3EKF5101V  [FP-ERJ3EK-MFG]
R27  ERJ-3EKF5101V  [FP-ERJ3EK-MFG]
R29  ERJ-3EKF5101V  [FP-ERJ3EK-MFG]
U1  MAX96724RGTN/V+  [QFN50P800X800X80_HS-57N]  (parts A,B of 2)
U2  LD1117S18TR  [SOT-223_M]
U3  AP7363-12E-13  [SOT-223_M]
Y1  ABM8G-25.000MHZ-18-D2Y-T  [FP-ABM8G-MFG]

### Ports
CAM_I2C_SCL (in, see MAIN_BOARD[5B], JETSON[8B]), CAM_I2C_SDA (bidir, see MAIN_BOARD[5B], JETSON[8B]), CAM_nPWDN (in, see MAIN_BOARD[5B]), CSI_CK_N (in, see MAIN_BOARD[5B]), CSI_CK_P (in, see MAIN_BOARD[5B]), CSI_D0_N (bidir, see MAIN_BOARD[5B]), CSI_D0_P (bidir, see MAIN_BOARD[5B]), CSI_D1_N (bidir, see MAIN_BOARD[5B]), CSI_D1_P (bidir, see MAIN_BOARD[5B]), CSI_D2_N (bidir, see MAIN_BOARD[5B]), CSI_D2_P (bidir, see MAIN_BOARD[5B]), CSI_D3_N (bidir, see MAIN_BOARD[5B]), CSI_D3_P (bidir, see MAIN_BOARD[5B]), PoC_PWR (in, see MAIN_BOARD[5B])

### Nets
2V_AUX: C42.2 C43.2 U2.3(VIN) U3.3(VIN)
3V3: C33.1 C34.2 R9.2 R12.2 R13.2 R17.2 R21.2 U1.24(VDDIO)
GND: C19.2 C20.2 C21.2 C22.1 C23.2 C24.1 C25.2 C26.1 C27.2 C28.1 C29.2 C30.1 C31.2 C32.1 C33.2 C34.1 C35.2 C36.1 C40.2 C41.2 C42.1 C43.1 C121.2 C122.2 C123.2 C124.2 D22.3(GND) D22.8(GND) D23.3(GND) D23.8(GND) D34.3(GND) D34.8(GND) D35.3(GND) D35.8(GND) J2.MH1 J2.MH2 J2.MH3 J2.MH4 J2.MH5 R10.1 R11.1 R15.1 R16.1 R18.1 R19.1 R20.1 U1.57(GND) U2.1(GND) U3.1(GND) Y1.2(GND) Y1.4(GND)
CAM_1V2: C25.1 C26.2 C27.1 C28.2 C35.1 C36.2 C41.1 U1.30(VTERM) U1.55(VDD) U1.56(VDD) U3.2(VOUT) U3.4(VOUT)
CAM_1V8: C29.1 C30.2 C31.1 C32.2 C40.1 U1.7(VDD18) U1.21(VDD18) U2.2(VOUT) U2.4(VOUT)
CAM_I2C_SCL: R21.1 U1.29(SCL) ; port CAM_I2C_SCL
CAM_I2C_SDA: R17.1 U1.28(SDA) ; port CAM_I2C_SDA
CK_N: C14.2 R7.2 R8.2
CK_P: C11.2 R5.2 R6.2
CKA_N: R8.1 U1.40(CKAN)
CKA_P: R6.1 U1.39(CKAP)
CKC_N: R7.1 U1.34(CKCN)
CKC_P: R5.1 U1.33(CKCP)
CSI_CK_N: C14.1 ; port CSI_CK_N
CSI_CK_P: C11.1 ; port CSI_CK_P
CSI_D0_N: C2.1 ; port CSI_D0_N
CSI_D0_P: C1.1 ; port CSI_D0_P
CSI_D1_N: C4.1 ; port CSI_D1_N
CSI_D1_P: C3.1 ; port CSI_D1_P
CSI_D2_N: C6.1 ; port CSI_D2_N
CSI_D2_P: C5.1 ; port CSI_D2_P
CSI_D3_N: C10.1 ; port CSI_D3_N
CSI_D3_P: C9.1 ; port CSI_D3_P
DA0_N: C2.2 U1.32(DA0N)
DA0_P: C1.2 U1.31(DA0P)
DA1_N: C4.2 U1.36(DA1N)
DA1_P: C3.2 U1.35(DA1P)
DA2_N: C6.2 U1.38(DA2N)
DA2_P: C5.2 U1.37(DA2P)
DA3_N: C10.2 U1.42(DA3N)
DA3_P: C9.2 U1.41(DA3P)
nPWDN: R14.2 ; port CAM_nPWDN
PoC_A: C7.2 D22.1(IO1) D22.10(NC) J2.3 L3.2  [also labelled RF_A]
PoC_B: C8.2 D22.5(IO4) D22.6(NC) D34.5(IO4) D34.6(NC) J2.4 L5.2  [also labelled RF_B]
PoC_C: C15.2 D23.1(IO1) D23.10(NC) J2.1 L7.2  [also labelled RF_C]
PoC_D: C16.2 D35.5(IO4) D35.6(NC) J2.2 L9.2  [also labelled RF_D]
PoC_PWR: C121.1 C122.1 C123.1 C124.1 L2.1 L4.1 L6.1 L8.1 R24.1 R26.1 R27.1 R29.1 ; port PoC_PWR
SIOA_N: C12.1 U1.22(SIOAN)
SIOA_P: C7.1 U1.23(SIOAP)
SIOB_N: C13.1 U1.19(SIOBN)
SIOB_P: C8.1 U1.18(SIOBP)
SIOC_N: C17.1 U1.9(SIOCN)
SIOC_P: C15.1 U1.10(SIOCP)
SIOD_N: C18.1 U1.6(SIODN)
SIOD_P: C16.1 U1.5(SIODP)
X25_N: C20.1 U1.16(X2) Y1.3
X25_P: C19.1 U1.15(X1/OSC) Y1.1
XRES: R20.2 U1.17(XRES)
NetC12_2: C12.2 R10.2
NetC13_2: C13.2 R11.2
NetC17_2: C17.2 R18.2
NetC18_2: C18.2 R19.2
NetC21_1: C21.1 C22.2 U1.8(CAP_VDD)
NetC23_1: C23.1 C24.2 U1.20(CAP_VDD)
NetL2_2: L2.2 L3.1 R24.2
NetL4_2: L4.2 L5.1 R26.2
NetL6_2: L6.2 L7.1 R27.2
NetL8_2: L8.2 L9.1 R29.2
NetR9_1: R9.1 R14.1 U1.11(PWDNB)
NetR12_1: R12.1 R15.2 U1.25(CFG1/MFP6)
NetR13_1: R13.1 R16.2 U1.4(CFG0)

Not connected (* = marked no-connect by the designer): D22 2(IO2) 4(IO3) 7(NC) 9(NC); D23 2(IO2) 4(IO3) 5(IO4) 6(NC) 7(NC) 9(NC); D34 1(IO1) 2(IO2) 4(IO3) 7(NC) 9(NC) 10(NC); D35 1(IO1) 2(IO2) 4(IO3) 7(NC) 9(NC) 10(NC); U1 1(MFP0)* 2(MFP1)* 3(MFP2)* 12(MFP3)* 13(MFP4)* 14(MFP5)* 26(SDA1/MFP7)* 27(SCL1/MFP8)* 43(NC)* 44(NC)* 45(NC)* 46(NC)* 47(NC)* 48(NC)* 49(NC)* 50(NC)* 51(NC)* 52(NC)* 53(NC)* 54(NC)*

### Channels
CAMIF_1: designators end in _CAMIF_1; ports CAM_I2C_SCL=CAM_I2C_SCL CAM_I2C_SDA=CAM_I2C_SDA CAM_nPWDN=CAM0_PWDN CSI_CK_N=CSI0_CLK_N CSI_CK_P=CSI0_CLK_P CSI_D0_N=CSI0_D0_N CSI_D0_P=CSI0_D0_P CSI_D1_N=CSI0_D1_N CSI_D1_P=CSI0_D1_P CSI_D2_N=CSI1_D0_N CSI_D2_P=CSI1_D0_P CSI_D3_N=CSI1_D1_N CSI_D3_P=CSI1_D1_P PoC_PWR=PoC_PWR_CAMIF_1
CAMIF_2: designators end in _CAMIF_2; ports CAM_I2C_SCL=CAM_I2C_SCL CAM_I2C_SDA=CAM_I2C_SDA CAM_nPWDN=CAM1_PWDN CSI_CK_N=CSI2_CLK_N CSI_CK_P=CSI2_CLK_P CSI_D0_N=CSI2_D0_N CSI_D0_P=CSI2_D0_P CSI_D1_N=CSI2_D1_N CSI_D1_P=CSI2_D1_P CSI_D2_N=CSI3_D0_N CSI_D2_P=CSI3_D0_P CSI_D3_N=CSI3_D1_N CSI_D3_P=CSI3_D1_P PoC_PWR=PoC_PWR_CAMIF_2

### Layout directives
differential pair: CK_N_CAMIF_1, CK_P_CAMIF_1, CKA_N_CAMIF_1, CKA_P_CAMIF_1, CKC_N_CAMIF_1, CKC_P_CAMIF_1, CSI0_CLK_N, CSI0_CLK_P, CSI0_D0_N, CSI0_D0_P, CSI0_D1_N, CSI0_D1_P, CSI1_D0_N, CSI1_D0_P, CSI1_D1_N, CSI1_D1_P, DA0_N_CAMIF_1, DA0_P_CAMIF_1, DA1_N_CAMIF_1, DA1_P_CAMIF_1, DA2_N_CAMIF_1, DA2_P_CAMIF_1, DA3_N_CAMIF_1, DA3_P_CAMIF_1, SIOA_N_CAMIF_1, SIOA_P_CAMIF_1, SIOB_N_CAMIF_1, SIOB_P_CAMIF_1, SIOC_N_CAMIF_1, SIOC_P_CAMIF_1, SIOD_N_CAMIF_1, SIOD_P_CAMIF_1, X25_N_CAMIF_1, X25_P_CAMIF_1
net class 50SINGLE: RF_A, RF_B, RF_C, RF_D
net class 100DIFF: CK_N, CK_P, CKA_N, CKA_P, CKC_N, CKC_P, DA0_N, DA0_P, DA1_N, DA1_P, DA2_N, DA2_P, DA3_N, DA3_P, PoC_A, PoC_B, PoC_D, SIOA_N, SIOA_P, SIOB_N, SIOB_P, SIOC_N, SIOC_P, SIOD_N, SIOD_P

### Notes on the sheet
- CSI + I2C + PoC IN
- GMSL Aggregator
- COAX Inputs
- (near R5) CLK MUX TO MAKE SURE CLK CAN BE WIRED
- (near R5) CSI WIRING AS PER PAGE 23 OF MAX96724 DS
- COAX is ok as 50ohm single ended but remove ground plane from under the pads of passives connected to the GMSL trace
- Line fault?
- prob no since poc>>
- I2C ADDR 0x5C
- (near R13) REMOVE PULLUP FOR 0x4E
- PLACE ALL PASSIVES AS CLOSE AS POSSIBLE TO MAX96724
- (near R15) GMSL2 3GB/s mode
- (near R15) COAX +
- Table 7 and 8 of DS for CFG configs
- 3V3 OR 1V8 I/O???
- MAX96724 has internal pull up but I added more
- MAX96724 PIN CONFIGS
- XRES --> 402 1% TO GND
  X1/X2 --> 30PF CAP --> 2*(CL-CSTRAY)
  SDA/SCL --> OK, EXTRA PULLUPS ADDED BUT INTERNAL ONES EXIST
  SDA1/SCL1 --> COULD CONVERT TO HSYNC/VSYNC FOR STATUS LEDS
  CFG1 --> GMSL2 3GB/s OVER COAX (TABLE 8 OF DS)
  CFG0 --> I2C ADDR (TABLE 7 OF DS)
  COMPONENT SUGGESTIONS IN TABLE 3 OF DS
  - DECOUPLING CAPS OK
- FAKRA + ESD PROT
- Cable assembly --> 095-820-157-006
  Connector --> FM4-NZRP-PCB-1
- (near U1) Alas we require 1V2, 1V8, and 3V3 for these fuckers. Probably do buck for 3V3 and LDO for 1V2 and 1V8 but ask smarter humans first
- Maybe LDO for 3V3 would be worthwhile
- BUCK + 1V2 & 1V8 LDOs
- PoC Supply
- Maybe add switch + ldo if core current is high - it's 600mA on the 1V2 rail alone so yes
- Table 5 of gmsl2 hardware design guide from analog
- POWER OVER COAX DIRECTLY FROM BATT SHOULD BE FINE PROVIDED THERE'S ENOUGH FILTERING - CASS
- Using C-2L-500 Coilcraft (#3) circuit but replaced  1210POC-223
- UNLABELLED RESISTORS ARE 0402 JUMPERS
- SERBAN THINKS THIS IS OK, MAY FIND MISTAKES WHILE ROUTING THOUGH
- (in symbol CMP-015-00011-2, part A) 1 of 2
- (in symbol CMP-015-00011-2, part B) 2 of 2

### Library data of the parts
C1-C18 C22 C24 C26 C28 C42 C43 = CMP-2000-05393-2: as C108 on sheet NVME; Voltage: 50V; Dielectric Material: Ceramic; Min Operating Temperature: -55°C; Depth: 0.5mm; Radiation Hardening: No; RoHS Compliant: Yes; Voltage Rating (DC): 50V; Lead Free: Lead Free; Resistor Type: Ceramic; Height: 0.5mm; Dielectric: X7R; Thickness: 0.022inch; Case/Package: 0402; Case Code (Metric): 1005; Termination: SMD/SMT; Capacitance: 100nF; Packaging: Tape and Reel; Max Operating Temperature: 125°C; Mount: Surface Mount; Package Quantity: 1; Width: 0.02inch; Weight: 2.3E-05oz; Voltage Rating: 50V; Tolerance: 10%; Construction: Flat; Case Code (Imperial): 0402; Length: 1mm; REACH SVHC: No SVHC; Series: C
C19 C20 = CMP-1035-00914-3: CAP CER 30PF 50V 5% NP0 0603; Manufacturer: KEMET; Automotive Grade: Grade 1; Temperature Coefficient: 30ppm/°C; Material: Ceramic; Temperature Characteristic: C0G; Tolerance: 0.05; Manufacturer Part Number: C0603C300J5GACTU; ComponentLink2URL: https://api.kemet.com/component-edge/download/datasheet/C0603C100J5GACAUTO.pdf; Automotive: Yes; Device Class L2: Capacitors; Device Class L1: Passive Components; Device Class L3: Ceramic Capacitors; RoHS: TRUE; Octopart: https://octopart.com/c0603c300j5gactu-kemet-199455; Lead Free: Yes; Value: 30 pF; Temperature Range High: +125°C; Category: Cap; Temperature: -55°C to +125°C; Package: C0603C-CF; Capacitance: 30 pF; Digikey Description: CAP CER 30PF 50V 5% NP0 0603; Height: 0.87mm; ComponentLink2Description: Datasheet; Temperature Range Low: -55°C; Mouser Description: Multilayer Ceramic Capacitors MLCC - SMD/SMT 50volts 30pF C0G 5%; Voltage Rating: 50 V
C21 C23 C25 C27 C29 C31 C33 C35 = CMP-13271-000002-1: CAP CER 10UF 10V X5R 0402; Manufacturer: Samsung; Temperature Coefficient: 15%; Tolerance: 20%; Material: Ceramic; Octopart: https://octopart.com/cl05a106mp5nunc-samsung-22457395; Voltage Rating: 10V; RoHS: TRUE; Value: 10uF; Height: 0.7mm; Digikey Description: CAP CER 10UF 10V X5R 0402; Automotive: No; Package: CL05A106MP5NUNC; Device Class L1: Passive Components; Capacitance: 10uF; Temperature Range High: +85°C; ComponentLink2Description: Datasheet; Device Class L2: Capacitors; Temperature Characteristic: X5R; Manufacturer Part Number: CL05A106MP5NUNC; Temperature: -55°C to +85°C; ComponentLink2URL: http://www.samsungsem.com/kr/support/product-search/mlcc/__icsFiles/afieldfile/2019/05/10/19-CL05A106MP5NUNC.pdf; Device Class L3: Ceramic Capacitors; Category: Cap; Temperature Range Low: -55°C; Ipc Land Pattern Name: CAPC10050X50; Lead Free: Yes
C30 C32 C34 C36 = CMP-1034-01887-3: CAP CER 10000PF 50V 20% X7R 0402; Manufacturer: Kemet; Value: 10,000 pF; Tolerance: 0.2; Temperature Coefficient: 15%; Material: Ceramic; Temperature Range Low: -55°C; Digikey Description: CAP CER 10000PF 50V 20% X7R 0402; Temperature Characteristic: X7R; Device Class L2: Capacitors; RoHS: TRUE; Temperature Range High: +125°C; Mouser Description: Cap Ceramic 0.01uF 50V X7R 20% SMD 1.0 x 0.5 mm 125 C Paper T/R; Package: C0402-BB; ComponentLink2URL: https://content.kemet.com/datasheets/KEM_C1002_X7R_SMD.pdf; Device Class L1: Passive Components; ComponentLink2Description: Datasheet; Height: 0.55mm; Automotive: No; Temperature: -55°C to +125°C; Capacitance: 10,000 pF; Manufacturer Part Number: C0402C103M5RACTU; Device Class L3: Ceramic Capacitors; Voltage Rating: 50 V; Ipc Land Pattern Name: CAPC10050X50; Category: Cap; Octopart: https://octopart.com/c0402c103m5ractu-kemet-17125571; Lead Free: Yes
C40 C41 = CMP-2006-02792-2: as C104 on sheet NVME; Packaging: Tape and Reel; Voltage Rating (DC): 6.3V; Width: 0.031inch; Termination: SMD/SMT; Dielectric: X5R; Package Quantity: 4000; Voltage Rating: 6.3V; Capacitance: 10uF; Case/Package: 0603; Min Operating Temperature: -55°C; Voltage: 6.3V; Length: 1.6mm; Thickness: 0.035inch; Lead Free: Lead Free; Depth: 0.8mm; Case Code (Imperial): 0603; Max Operating Temperature: 85°C; Material: Ceramic; Height: 0.8mm; Tolerance: 20%; Mount: Surface Mount; REACH SVHC: No SVHC; Radiation Hardening: No; Case Code (Metric): 1608
C121-C124 = CMP-2007-03222-3: Chip Multilayer Ceramic Capacitors for General Purpose, 0805, 22uF, X5R, 15%, 20%, 25V; Case/Package: 0805; Depth: 1.25mm; Resistor Type: Ceramic; Voltage Rating: 25V; Lead Free: Lead Free; Voltage Rating (DC): 25V; Case Code (Metric): 2012; Thickness: 0.057inch; REACH SVHC: No SVHC; Material: Ceramic; Tolerance: 20%; Length: 2mm; Capacitance: 22uF; Case Code (Imperial): 0805; Max Operating Temperature: 85°C; Termination: SMD/SMT; Weight: 0.000335oz; Dielectric: X5R; Packaging: Tape and Reel; Voltage: 25V; Package Quantity: 3000; Height: 1.25mm; Mount: Surface Mount; Width: 1.25mm; Min Operating Temperature: -55°C
D22 D23 D34 D35 = CMP-04989-000002-1: as D30-D32 on sheet HDMI; Ambient Temperature Range High: +125°C; ComponentLink2Description: Datasheet; Height: 0.55mm; Lead Free: Yes; Device Class L3: unset; Temperature Range High: +125°C; Temperature Range Low: -40°C; Package: DQA0010A; Temperature: -40°C to +125°C; Capacitance: 0.55pF; RoHS: TRUE; Mouser Description: 4-Channel Low-Capacitance Surge and ESD Protection Diode 10-USON -40 to 125; Category: Diode; Device Class L1: Circuit Protection; Octopart: https://octopart.com/esd204dqar-texas+instruments-89917476; Device Class L2: TVS Diodes; Ambient Temperature Range Low: -40°C; Manufacturer Part Number: ESD204DQAR; ComponentLink2URL: http://www.ti.com/lit/ds/symlink/esd204.pdf; Automotive: No; Digikey Description: 4-CHANNEL LOW-CAPACITANCE SURGE
J2 = CMP-002-00085-1: Connector RF Mini-FAKRA Plug 9GHz 50Ohm Solder Right Angle Through Hole
L2 L4 L6 L8 = CMP-11268-000041-1: NOT COILCRAFT - ACTUAL P# --> ADL32VHC-220M / - Power Injection Chokes for PoC; Manufacturer Part Number: 1210POC-223MRC; Value: 22uH; Core Material: Ferrite; Saturation Current: 720mA; Series Resistance: 0.88Ω; Rms Current: 700mA; Automotive Grade: Grade 1; Self Resonant Frequency: 70MHz; Test Frequency: 100kHz; Tolerance: 20%; Ambient Temperature Range High: +125°C; Manufacturer: coilcraft; Octopart: https://octopart.com/1210poc-223mrc-coilcraft-103207315; Category: Ind; Device Class L2: Inductors; RoHS: TRUE; Device Class L3: Fixed Inductors; Package: 1210POC; Ambient Temperature Range Low: -40°C; ComponentLink2URL: https://drive.google.com/open?id=15FlOq8Y4YbRFohfA_cJ40jgnqs8va2Mh; Lead Free: Yes; Inductance: 22uH; Device Class L1: Passive Components; ComponentLink2Description: Datasheet; Automotive: Yes; Height: 3mm
L3 L5 L7 L9 = CMP-11268-000007-1: Fixed Inductors PFL1609 Low Profile 0.56 uH 20 % 1.4 A; Manufacturer: coilcraft; Rms Current: 1100mA; Self Resonant Frequency: 600MHz; Core Material: Composite; Tolerance: 20%; Value: 0.56uH; Automotive Grade: Grade 1; Saturation Current: 710mA; Test Frequency: 7.9MHz; Shielding: true; Series Resistance: 130mΩ; Lead Free: Yes; Device Class L1: Passive Components; Package: PFL1609; Octopart: https://octopart.com/pfl1609-561mew-coilcraft-20329171; ComponentLink2URL: https://www.coilcraft.com/pdfs/pfl1609.pdf; Manufacturer Part Number: PFL1609-561MEW; Ambient Temperature Range Low: -40°C; Composition: Wirewound; Inductance: 0.56uH; Device Class L2: Inductors; Category: Ind; Device Class L3: Fixed Inductors; Mouser Description: Fixed Inductors PFL1609 Low Profile 0.56 uH 20 % 1.4 A; Automotive: Yes; ComponentLink2Description: Datasheet; Ambient Temperature Range High: +105°C; Height: 0.95mm; RoHS: TRUE
R5-R8 R14 = CMP-009-00206-2: READ THE NAME
R9 R17 R21 = CMP-1012-00623-3: Chip Resistor, 10 KOhm, +/- 1%, 0.1 W, -55 to 155 degC, 0603 (1608 Metric), RoHS, Tape and Reel; Manufacturer: Panasonic; Voltage Rating: 75V; Case\/Package: 0603; Power Rating: 100mW; Resistance: 10KOhm; Temperature Coefficient: 100ppm\/degreesC; Number of Pins: 2; Package Reference: 603; Depth: 0.8mm; Mount: SurfaceMount; Package Description: 2-Pin Surface Mount Device, Body 1.6 x 0.85 mm; Datasheet Version: 02/2017; Length: 1.6mm; Lead Free: LeadFree; Height: 0.45mm; Number of Terminations: 2; Max Power Dissipation: 100mW; Min Operating Temperature: -55degC; Datasheet URL: https://industrial.panasonic.com/cdbs/www-data/pdf/RDA0000/AOA0000C304.pdf; Termination: SMD/SMT; Case Code (Metric): 1608; Case Code (Imperial): 0603; Tolerance: 1%; Max Operating Temperature: 155degC; RoHSCompliant: true; Voltage Rating (DC): 75V; Radiation Hardening: No; Packaging: TapeandReel; Composition: ThickFilm; Mounting Technology: SurfaceMount; Manufacturer URL: http://www.panasonic.com/; Width: 0.031inch; REACH SVHC: NoSVHC; Contact Plating: Tin; Military Standard: Not; Package Quantity: 1
R10 R11 R18 R19 = CMP-2000-00538-1: Manufacturer: Panasonic; Part Number: ERJ-3EKF49R9V
R12 R13 = CMP-2000-00651-1: Manufacturer: Panasonic; Part Number: ERJ-3EKF8062V
R15 R16 = CMP-2000-00323-1: Manufacturer: Panasonic; Part Number: ERJ-3EKF2052V
R20 = CMP-2000-00484-1: Manufacturer: Panasonic; Part Number: ERJ-3EKF4020V
R24 R26 R27 R29 = CMP-2000-00540-8: RES SMD 5.1K OHM 1% 1/10W 0603; Power Rating: 100mW; Temperature Coefficient: 100ppm/°C; Voltage Rating: 75V; Resistance: 5.1kR; Military Standard: Not; Case/Package: 0603; Packaging: Tape and Reel; Package Quantity: 1; Reach SVHC Compliant: Yes; Lead Free: Lead Free; Mount: Surface Mount; Size Code: 0603; Depth: 0.8mm; Resistance Tolerance: 1%; Number of Terminations: 2; Resistor Type: Thick Film; Width: 0.8mm; Construction: Rectangular; Series: ERJ; Radiation Hardening: No; Max Operating Temperature: 155°C; Features: Automotive AEC-Q200; Tolerance: 1%; Voltage Rating (DC): 75V; Length: 1.6mm; RoHS Compliant: Yes; Min Operating Temperature: -55°C; Case Code (Metric): 1608; Termination: SMD/SMT; Weight: 7.1E-05oz; Max Power Dissipation: 100mW; Contact Plating: Tin; Height: 0.022inch; Case Code (Imperial): 0603
U1 = CMP-015-00011-2: Quad Tunneling GMSL2/1 to CSI-2 Deserializer
U2 = CMP-0244-00308-1: Fixed Low Drop Positive Voltage Regulator, 1.8V, 4-Pin SOT-223, Tape and Reel; ComponentLink1URL: http://www.st.com; PackageReference: SOT-223; PackageDescription: 4-Pin SOT-223 Package, 6.5 x 3.5 mm Body, 2.3 mm Pitch, 7 mm Lead Span; ComponentLink2URL: http://www.st.com/internet/com/TECHNICAL_RESOURCES/TECHNICAL_LITERATURE/DATASHEET/CD00000544.pdf; ComponentLink2Description: Datasheet; ComponentLink1Description: Manufacturer URL; DatasheetVersion: 1/11/2011; PackageVersion: 2010
U3 = CMP-0244-00318-1: Fixed Low Drop Positive Voltage Regulator, 1.2V (pn is for 1.5A LDO), 4-Pin SOT-223, Tape and Reel; PackageDescription: 4-Pin SOT-223 Package, 6.5 x 3.5 mm Body, 2.3 mm Pitch, 7 mm Lead Span; PackageVersion: 2010; ComponentLink2Description: Datasheet; PackageReference: SOT-223; ComponentLink2URL: http://www.st.com/internet/com/TECHNICAL_RESOURCES/TECHNICAL_LITERATURE/DATASHEET/CD00000544.pdf; ComponentLink1Description: Manufacturer URL; DatasheetVersion: 1/11/2011; ComponentLink1URL: http://www.st.com
Y1 = CMP-2000-05733-3: Crystal 25MHz ±20ppm (Tol) ±30ppm (Stability) 18pF FUND 60Ω 4-Pin SMD T/R; Series Resistance: 60R; Length: 3.2mm; Depth: 2.5mm; Packaging: Tape and Reel; Min Operating Temperature: -40°C; Operating Frequency: 25 MHz; Lead Free: Lead Free; Number of Pins: 4; Frequency Tolerance: 20ppm; Radiation Hardening: No; Max Operating Temperature: 85°C; Termination: SMD/SMT; Frequency Stability: 30ppm; Frequency: 25MHz; Series: ABM8G; Mount: Surface Mount; Package Quantity: 1000; Height: 0.039inch; Width: 0.098inch; Case/Package: CSMD; ESR (Equivalent Series Resistance): 60R; Load Capacitance: 18pF; Tolerance: 20ppm

## Sheet RECOVERY_USBC.SchDoc
size A4; SheetNumber: 8; SheetTotal: 8
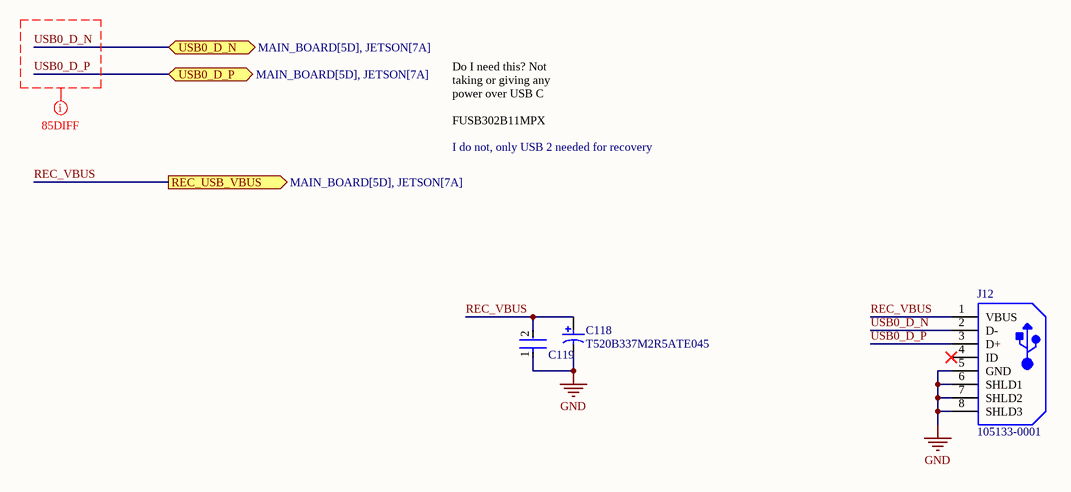
[diagram p20: RECOVERY_USBC.SchDoc]

### Parts
C118  T520B337M2R5ATE045  [KEMT-520-B-2_M]
C119  C1005X7R1H104K050BB  [FP-C1005-050-0_05-IPC_C]  (value not drawn)
J12  105133-0001  [MOLX-105133-0001_V]

### Ports
REC_USB_VBUS (out, see MAIN_BOARD[5D], JETSON[7A]), USB0_D_N (bidir, see MAIN_BOARD[5D], JETSON[7A]), USB0_D_P (bidir, see MAIN_BOARD[5D], JETSON[7A])

### Nets
GND: C118.2 C119.1 J12.5(GND) J12.6(SHLD1) J12.7(SHLD2) J12.8(SHLD3)
REC_VBUS: C118.1 C119.2 J12.1(VBUS) ; port REC_USB_VBUS  [project net REC_USB_VBUS]
USB0_D_N: J12.2(D-) ; port USB0_D_N
USB0_D_P: J12.3(D+) ; port USB0_D_P

Not connected (* = marked no-connect by the designer): J12 4(ID)*

### Layout directives
net class 85DIFF: USB0_D_N, USB0_D_P

### Notes on the sheet
- Do I need this? Not taking or giving any power over USB C
  FUSB302B11MPX
- I do not, only USB 2 needed for recovery

### Library data of the parts
C118 = CMP-1664-00002-2: Tantalum Capacitor, 330 uF, +/- 20%, 2.5 V, -55 to 105 degC, 2-Pin Molded, RoHS, Tape and Reel; Capacitance: 330 uF; PartNumber: T520B337M2R5ATE045; DatasheetVersion: 07/2016; Radiation Hardening: No; ComponentLink2Description: Datasheet; PackageDescription: 2-Pin Surface Mount Device, Body 3.5 x 2.8 mm; Width: 2.8 mm; ComponentLink2URL: http://capacitoredge.kemet.com/capedge2/DataSheet?pn=T520B337M2R5ATE045; Case/Package: 1411; Length: 3.5 mm; Package Quantity: 2000; Max Operating Temperature: 105 degC; Mounting Technology: Surface Mount; Height: 2.1 mm; RoHSCompliant: True; ComponentLink1URL: http://www.kemet.com/; Mount: Surface Mount; Packaging: Tape and Reel; ComponentLink1Description: Manufacturer URL; Min Operating Temperature: -55 degC
C119 = CMP-2000-05393-2: as C108 on sheet NVME; Voltage: 50V; Dielectric Material: Ceramic; Min Operating Temperature: -55°C; Depth: 0.5mm; Radiation Hardening: No; RoHS Compliant: Yes; Voltage Rating (DC): 50V; Lead Free: Lead Free; Resistor Type: Ceramic; Height: 0.5mm; Dielectric: X7R; Thickness: 0.022inch; Case/Package: 0402; Case Code (Metric): 1005; Termination: SMD/SMT; Capacitance: 100nF; Packaging: Tape and Reel; Max Operating Temperature: 125°C; Mount: Surface Mount; Package Quantity: 1; Width: 0.02inch; Weight: 2.3E-05oz; Voltage Rating: 50V; Tolerance: 10%; Construction: Flat; Case Code (Imperial): 0402; Length: 1mm; REACH SVHC: No SVHC; Series: C
J12 = CMP-2000-05829-1: Micro-USB B Receptacle, Vertical, -30 to 85 degC, 5-Pin SMD, RoHS, Tape and Reel; Manufacturer: Molex; Package Version: Rev. C, 11/2015; Voltage Rating: 30VAC; Connector Type: MicroUSBTypeBReceptacle; Current Rating: 1.8A; Number of Ports: 1; Voltage - Max: 30V; Mounting Style: SMD/SMT; Packaging: Reel; Product: MicroUSBTypeBConnectors; Contact Plating: Gold; Flammability Rating: UL94V-0; Package Description: 5-Pin Surface Mount Device, Pitch 0.65 mm; Package Reference: 105133-0001; Contact Material: CopperAlloy; Mounting Angle: Vertical; RoHS: Details; Manufacturer URL: http://www.molex.com/; Factory Pack Quantity: 6000; PartNumber: 105133-0001; Standard: USB; Brand: Molex; Series: 105133; Product Category: USBConnectors; Termination Style: SolderTail; Gender: Receptacle; Package URL: http://www.molex.com/pdm_docs/sd/1051330001_sd.pdf; Datasheet Version: 03/2016; Color: Black; Datasheet URL: http://www.molex.com/webdocs/datasheets/pdf/en-us/1051330001_IO_CONNECTORS.pdf; Mounting Technology: SurfaceMount

## Sheet FAN_IF.SchDoc
size A4; SheetNumber: 9; SheetTotal: 9
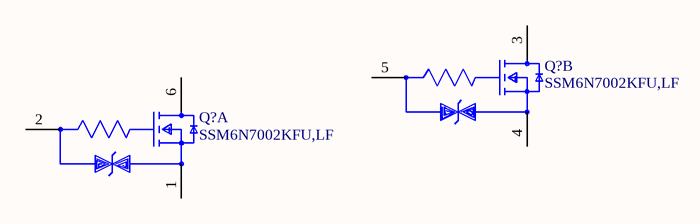
[diagram p21: FAN_IF.SchDoc]

### Parts
(Parts that share a designator on the sheet are numbered #1, #2 ... from top to bottom, then left to right.)
Q?#1  SSM6N7002KFU,LF  [FP-SSOP6-P-0_65A-MFG]  (part B of 2)
Q?#2  SSM6N7002KFU,LF  [FP-SSOP6-P-0_65A-MFG]  (part A of 2)

### Nets

Not connected (* = marked no-connect by the designer): Q?#1 3(Drain2) 4(Source2) 5(Gate2); Q?#2 1(Source1) 2(Gate1) 6(Drain1)

### Library data of the parts
Q?#1 Q?#2 = CMP-35916-000009-1: MOSFET 2N-CH 60V 0.3A; Input Capacitance: 40pF; Continuous Drain Current (ID): 300mA; Max Power Dissipation: 285mW; FET Type: 2 N-Channel; Rds On Max: 1.5R; Mount: Surface Mount; Drain to Source Voltage (Vdss): 60V; Packaging: Tape and Reel

## Nets that join several sheets
2V_AUX: USB (C78.2 U7.3), HDMI (R55.1), CAMIF_1 (C42_CAMIF_1.2 C43_CAMIF_1.2 U2_CAMIF_1.3 U3_CAMIF_1.3), CAMIF_2 (C42_CAMIF_2.2 C43_CAMIF_2.2 U2_CAMIF_2.3 U3_CAMIF_2.3)
3V3: USB (12 pins), ETHERNET (C81.2 R63.2 R64.2), NVME (22 pins), CAMIF_1 (8 pins), CAMIF_2 (8 pins)
5V_MAIN: JETSON (10 pins), HDMI (C85.1 C86.2 U9.5)
GND: JETSON (114 pins), USB (56 pins), ETHERNET (9 pins), HDMI (32 pins), NVME (31 pins), CAMIF_1 (51 pins), RECOVERY_USBC (6 pins), CAMIF_2 (51 pins)
CAM0_PWDN: JETSON (J1.116), CAMIF_1 (R14_CAMIF_1.2)
CAM1_PWDN: JETSON (J1.120), CAMIF_2 (R14_CAMIF_2.2)
CAM_I2C_SCL: MAIN_BOARD (TP9.1), JETSON (D18.4 D18.7 J1.213), CAMIF_1 (R21_CAMIF_1.1 U1_CAMIF_1.29), CAMIF_2 (R21_CAMIF_2.1 U1_CAMIF_2.29)
CAM_I2C_SDA: MAIN_BOARD (TP8.1), JETSON (D18.5 D18.6 J1.215), CAMIF_1 (R17_CAMIF_1.1 U1_CAMIF_1.28), CAMIF_2 (R17_CAMIF_2.1 U1_CAMIF_2.28)
CSI0_CLK_N: JETSON (D6.2 D6.9 J1.10), CAMIF_1 (C14_CAMIF_1.1)
CSI0_CLK_P: JETSON (D6.1 D6.10 J1.12), CAMIF_1 (C11_CAMIF_1.1)
CSI0_D0_N: JETSON (D6.5 D6.6 J1.4), CAMIF_1 (C2_CAMIF_1.1)
CSI0_D0_P: JETSON (D6.4 D6.7 J1.6), CAMIF_1 (C1_CAMIF_1.1)
CSI0_D1_N: JETSON (R3.2), CAMIF_1 (C4_CAMIF_1.1)
CSI0_D1_P: JETSON (R4.2), CAMIF_1 (C3_CAMIF_1.1)
CSI1_D0_N: JETSON (R1.2), CAMIF_1 (C6_CAMIF_1.1)
CSI1_D0_P: JETSON (R2.2), CAMIF_1 (C5_CAMIF_1.1)
CSI1_D1_N: JETSON (D7.4 D7.7 J1.15), CAMIF_1 (C10_CAMIF_1.1)
CSI1_D1_P: JETSON (D7.5 D7.6 J1.17), CAMIF_1 (C9_CAMIF_1.1)
CSI2_CLK_N: JETSON (D19.1 D19.10 J1.28), CAMIF_2 (C14_CAMIF_2.1)
CSI2_CLK_P: JETSON (D19.2 D19.9 J1.30), CAMIF_2 (C11_CAMIF_2.1)
CSI2_D0_N: JETSON (D13.4 D13.7 J1.22), CAMIF_2 (C2_CAMIF_2.1)
CSI2_D0_P: JETSON (D13.5 D13.6 J1.24), CAMIF_2 (C1_CAMIF_2.1)
CSI2_D1_N: JETSON (D19.4 D19.7 J1.34), CAMIF_2 (C4_CAMIF_2.1)
CSI2_D1_P: JETSON (D19.5 D19.6 J1.36), CAMIF_2 (C3_CAMIF_2.1)
CSI3_D0_N: JETSON (D14.1 D14.10 J1.21), CAMIF_2 (C6_CAMIF_2.1)
CSI3_D0_P: JETSON (D14.2 D14.9 J1.23), CAMIF_2 (C5_CAMIF_2.1)
CSI3_D1_N: JETSON (D14.4 D14.7 J1.33), CAMIF_2 (C10_CAMIF_2.1)
CSI3_D1_P: JETSON (D14.5 D14.6 J1.35), CAMIF_2 (C9_CAMIF_2.1)
DP1_AUX_N: JETSON (D20.4 D20.7 J1.98), HDMI (Q2.2 R79.1)
DP1_AUX_P: JETSON (D20.5 D20.6 J1.100), HDMI (Q3.3 R87.1)
DP1_HPD: JETSON (D20.2 D20.9 J1.96), HDMI (Q1.3 R72.1)
DP1_TXD0_N: JETSON (D8.1 D8.10 J1.63), HDMI (C88.1)
DP1_TXD0_P: JETSON (D8.2 D8.9 J1.65), HDMI (C87.1)
DP1_TXD1_N: JETSON (D8.4 D8.7 J1.69), HDMI (C92.1)
DP1_TXD1_P: JETSON (D8.5 D8.6 J1.71), HDMI (C89.1)
DP1_TXD2_N: JETSON (D15.1 D15.10 J1.75), HDMI (C94.1)
DP1_TXD2_P: JETSON (D15.2 D15.9 J1.77), HDMI (C93.1)
DP1_TXD3_N: JETSON (D15.4 D15.7 J1.81), HDMI (C96.1)
DP1_TXD3_P: JETSON (D15.5 D15.6 J1.83), HDMI (C95.1)
DP_HDMI_CEC: JETSON (D20.1 D20.10 J1.94), HDMI (R93.1)
GBE_LED_ACT: JETSON (J1.194), ETHERNET (J5.L4)
GBE_LED_LINK: JETSON (J1.188), ETHERNET (J5.L2)
GBE_MDI0_N: JETSON (D5.1 D5.10 J1.184), ETHERNET (J5.2)
GBE_MDI0_P: JETSON (D5.2 D5.9 J1.186), ETHERNET (J5.1)
GBE_MDI1_N: JETSON (D5.4 D5.7 J1.190), ETHERNET (J5.4)
GBE_MDI1_P: JETSON (D5.5 D5.6 J1.192), ETHERNET (J5.3)
GBE_MDI2_N: JETSON (D12.1 D12.10 J1.196), ETHERNET (J5.8)
GBE_MDI2_P: JETSON (D12.2 D12.9 J1.198), ETHERNET (J5.7)
GBE_MDI3_N: JETSON (D12.4 D12.7 J1.202), ETHERNET (J5.10)
GBE_MDI3_P: JETSON (D12.5 D12.6 J1.204), ETHERNET (J5.9)
PCIE0_CLK_N: JETSON (D18.1 D18.10 J1.160), NVME (C116.2)
PCIE0_CLK_P: JETSON (D18.2 D18.9 J1.162), NVME (C117.2)
PCIE0_nRST: JETSON (D2.2 D2.9 J1.181), NVME (R112.2)
PCIE0_RX0_N: JETSON (D10.1 D10.10 J1.131), NVME (R104.2)
PCIE0_RX0_P: JETSON (D10.2 D10.9 J1.133), NVME (R105.2)
PCIE0_RX1_N: JETSON (D10.4 D10.7 J1.137), NVME (R101.2)
PCIE0_RX1_P: JETSON (D10.5 D10.6 J1.139), NVME (R103.2)
PCIE0_RX2_N: JETSON (D17.1 D17.10 J1.149), NVME (R99.2)
PCIE0_RX2_P: JETSON (D17.2 D17.9 J1.151), NVME (R100.2)
PCIE0_RX3_N: JETSON (D17.4 D17.7 J1.155), NVME (R97.2)
PCIE0_RX3_P: JETSON (D17.5 D17.6 J1.157), NVME (R98.2)
PCIE0_TX0_N: JETSON (D21.1 D21.10 J1.134), NVME (C107.2)
PCIE0_TX0_P: JETSON (D21.2 D21.9 J1.136), NVME (C114.2)
PCIE0_TX1_N: JETSON (D21.4 D21.7 J1.140), NVME (C102.2)
PCIE0_TX1_P: JETSON (D21.5 D21.6 J1.142), NVME (C103.2)
PCIE0_TX2_N: JETSON (D11.1 D11.10 J1.148), NVME (C100.2)
PCIE0_TX2_P: JETSON (D11.2 D11.9 J1.150), NVME (C101.2)
PCIE0_TX3_N: JETSON (D11.4 D11.7 J1.154), NVME (C98.2)
PCIE0_TX3_P: JETSON (D11.5 D11.6 J1.156), NVME (C99.2)
REC_USB_VBUS: JETSON (Q6.1 R22.2), RECOVERY_USBC (C118.1 C119.2 J12.1)
USB0_D_N: JETSON (D9.1 D9.10 J1.109), RECOVERY_USBC (J12.2)
USB0_D_P: JETSON (D9.2 D9.9 J1.111), RECOVERY_USBC (J12.3)
USB1_D_N: JETSON (D9.4 D9.7 J1.115), USB (R30.1)
USB1_D_P: JETSON (D9.5 D9.6 J1.117), USB (R31.1)
USBSS0_RX_N: JETSON (D16.1 D16.10 J1.161), USB (R33.1)
USBSS0_RX_P: JETSON (D16.2 D16.9 J1.163), USB (R34.1)
USBSS0_TX_N: JETSON (D16.4 D16.7 J1.166), USB (R35.1)
USBSS0_TX_P: JETSON (D16.5 D16.6 J1.168), USB (R36.1)